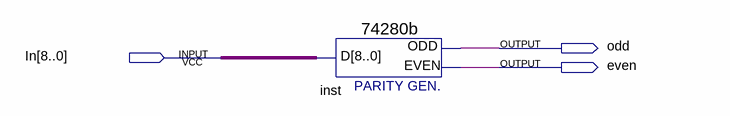
[diagram p0: schematic sheet]
// Quartus schematic ex6_8.bdf as structural Verilog: 1 symbols, 3 pins
module ex6_8 (
  input  [8:0] In,
  output odd,
  output even
);

  \74280b  inst (.D(In), .ODD(odd), .EVEN(even));
endmodule
